# EAGLE design MemoryExpansion (EAGLE 8.3.1)
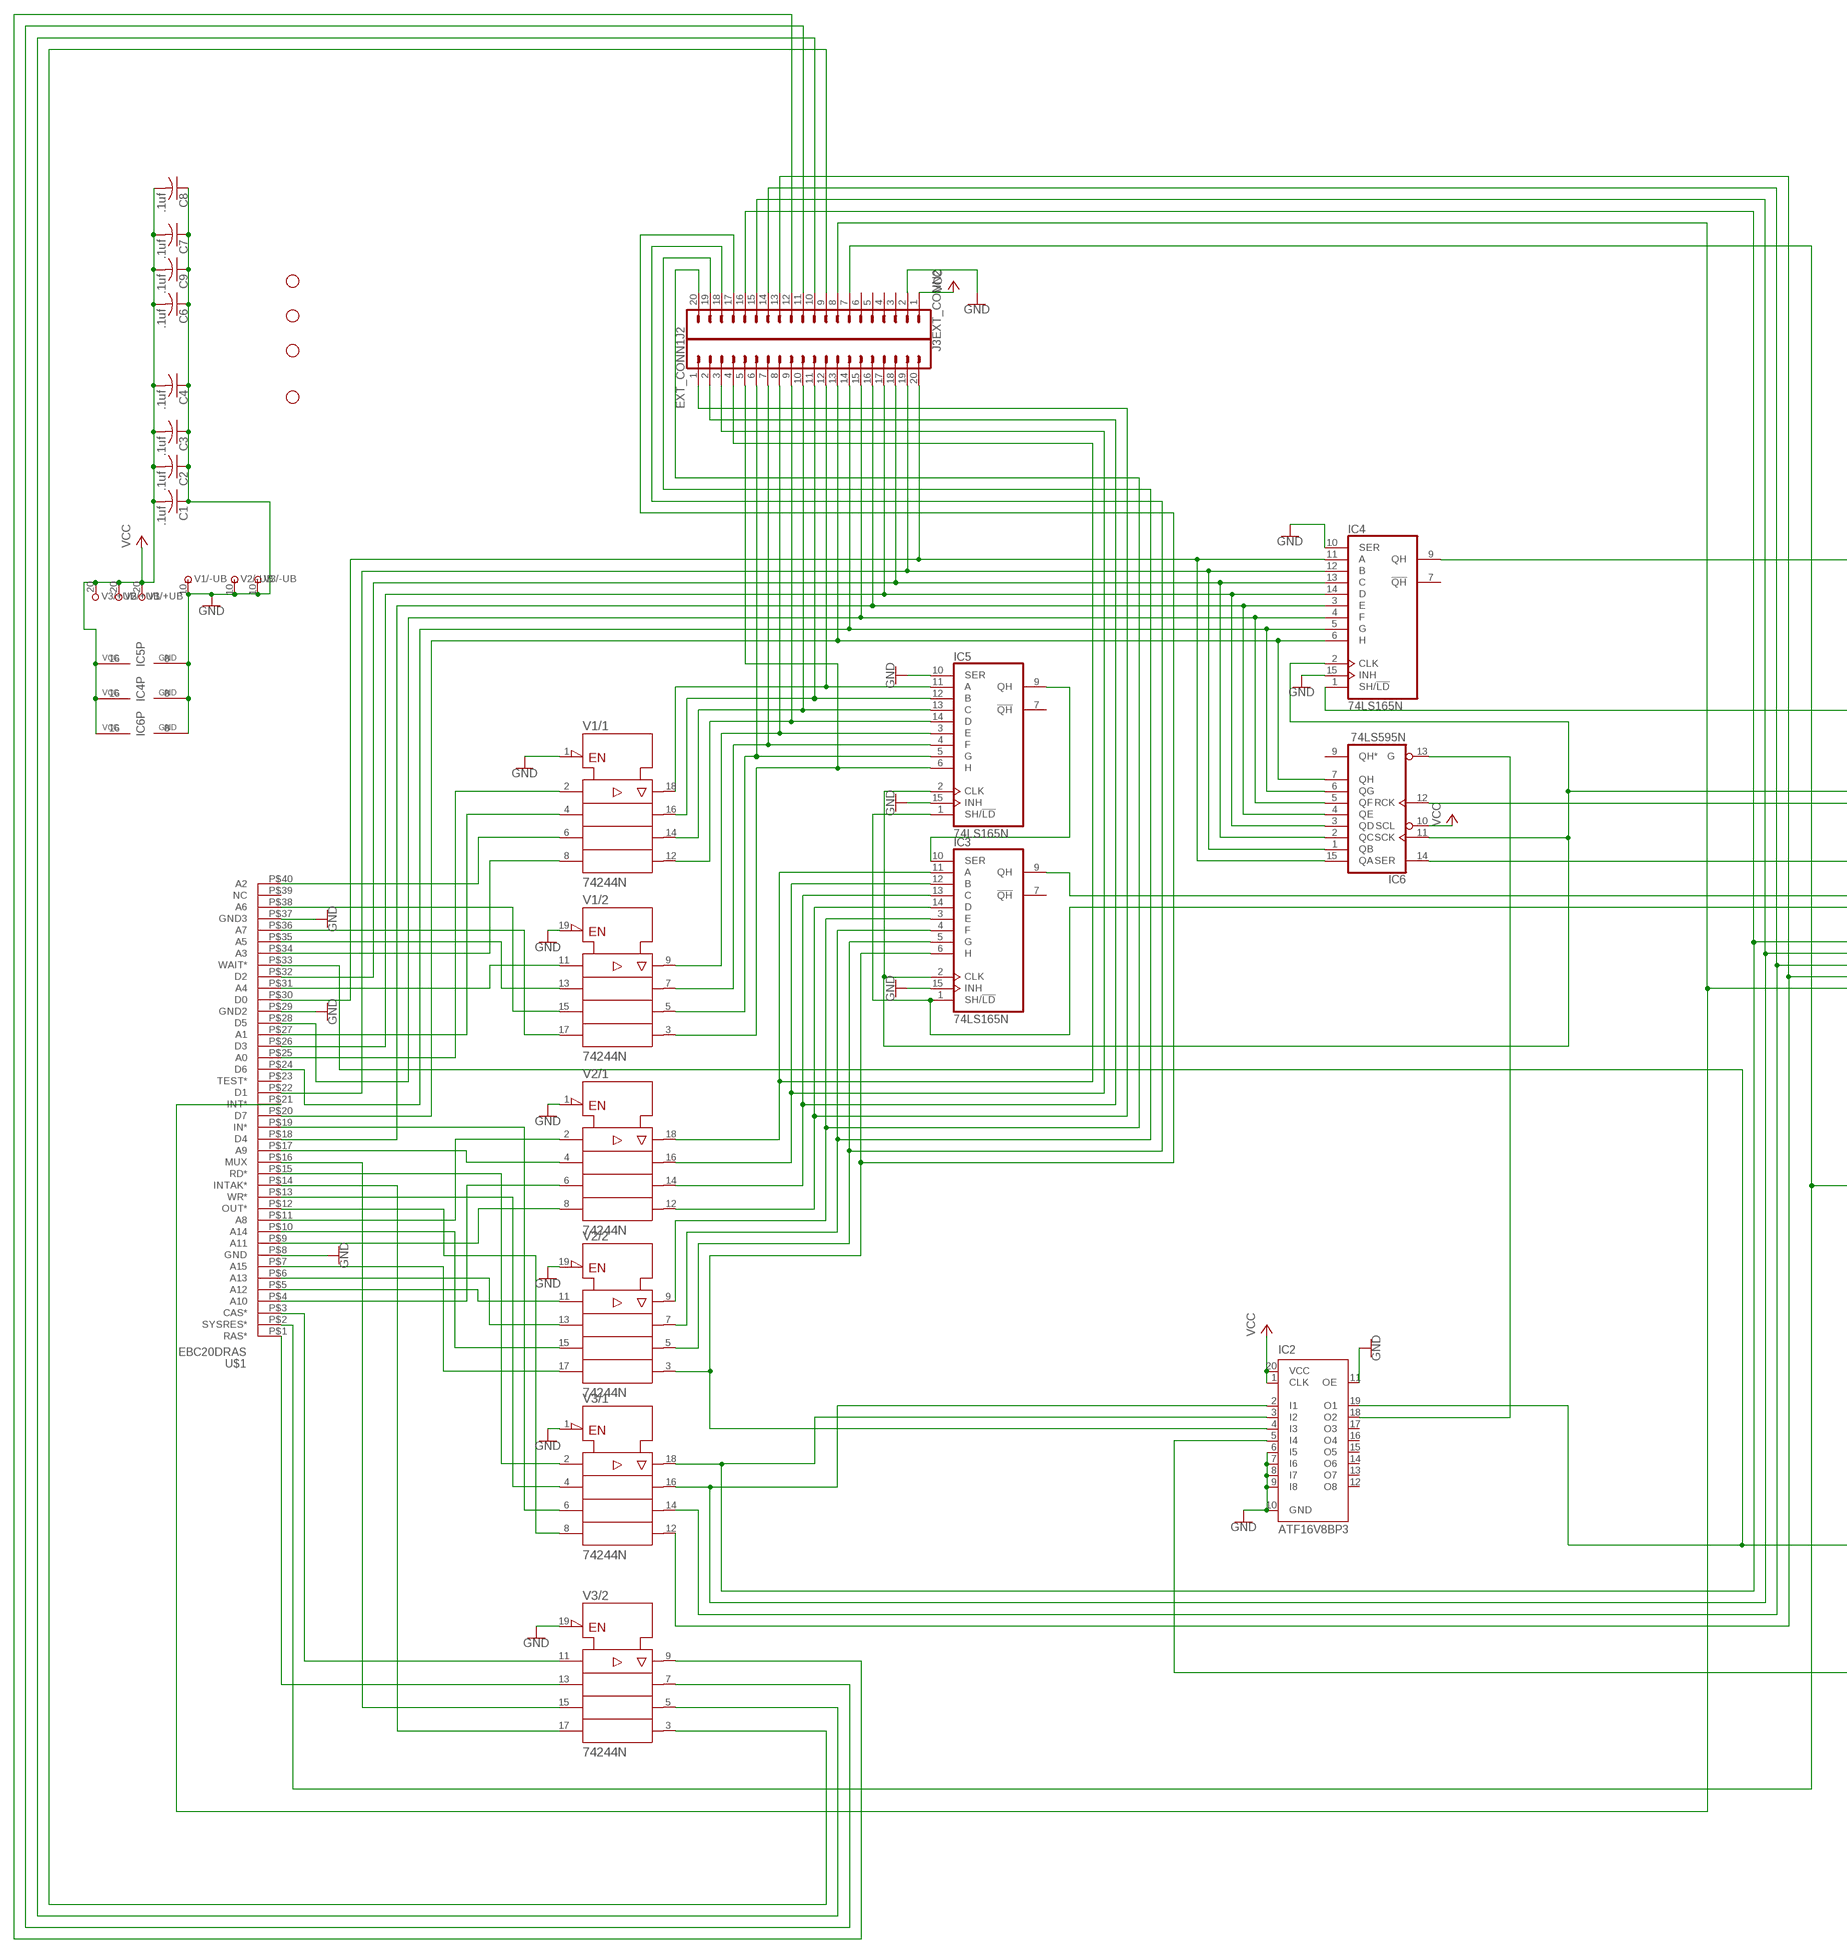
[diagram p0: schematic, sheet 1, part 1 of 2]
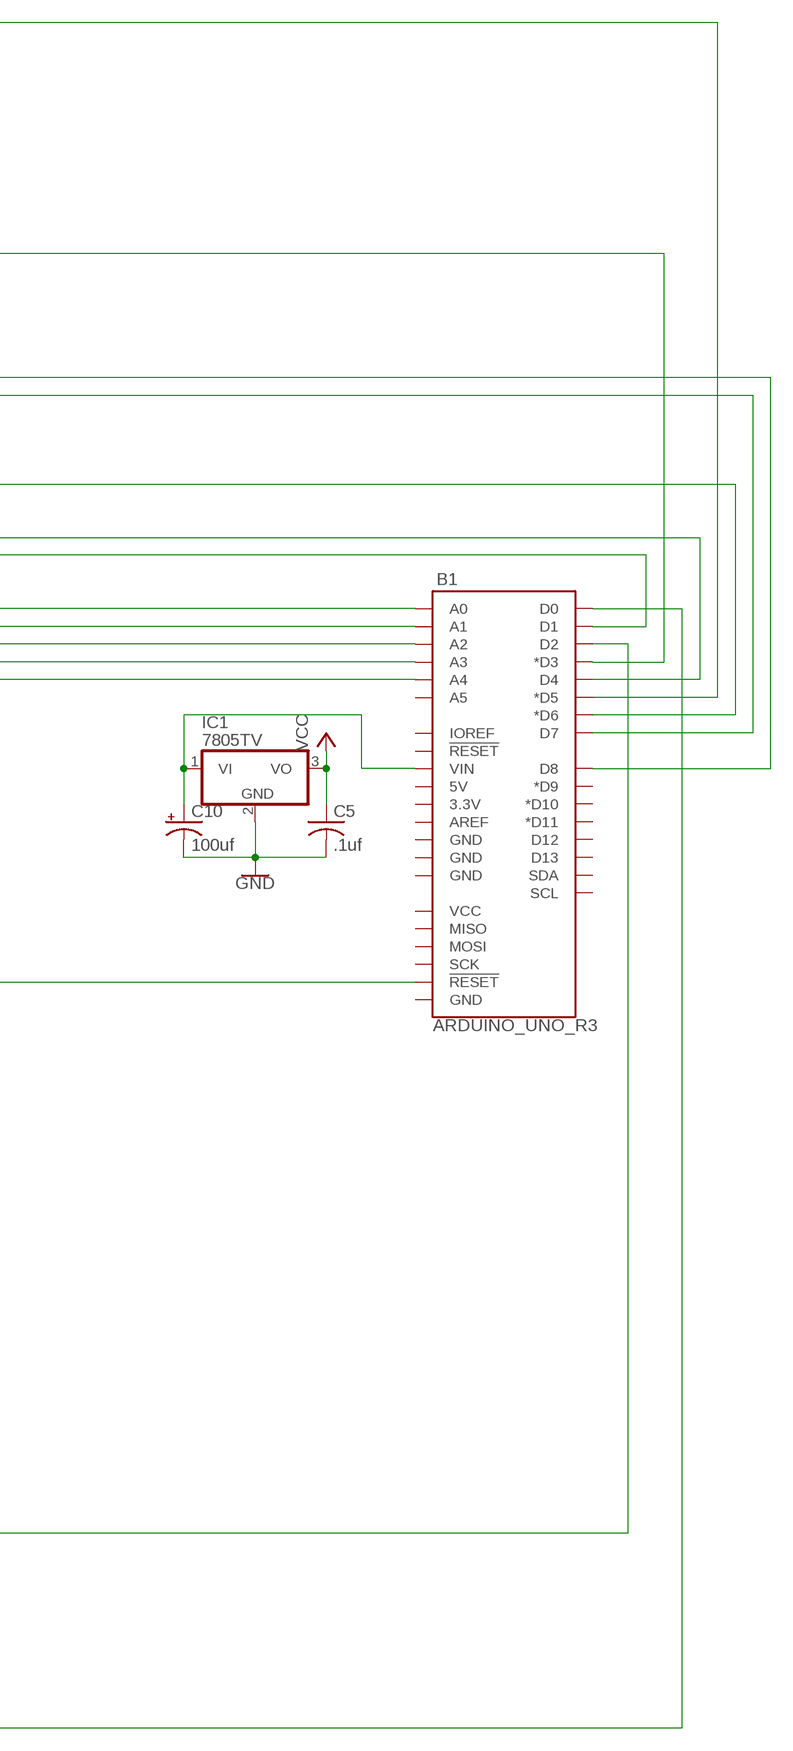
[diagram p1: schematic, sheet 1, part 2 of 2]

## Parts
B1  ARDUINO_UNO_R3  [ARDUINO_R3]
C1  .1uf  C-US025-024X044  [C025-024X044]
C2  .1uf  C-US025-024X044  [C025-024X044]
C3  .1uf  C-US025-024X044  [C025-024X044]
C4  .1uf  C-US025-024X044  [C025-024X044]
C5  .1uf  C-US025-024X044  [C025-024X044]
C6  .1uf  C-US025-024X044  [C025-024X044]
C7  .1uf  C-US025-024X044  [C025-024X044]
C8  .1uf  C-US025-024X044  [C025-024X044]
C9  .1uf  C-US025-024X044  [C025-024X044]
C10  100uf  CPOL-USE2-5  [E2-5]
H1  STAND-OFF  [STAND-OFF]
H2  STAND-OFF  [STAND-OFF]
H3  STAND-OFF  [STAND-OFF]
H4  STAND-OFF  [STAND-OFF]
IC1  7805TV  [TO220V]
IC2  ATF16V8BP3  [DIL20]
IC3  74LS165N  [DIL16]
IC4  74LS165N  [DIL16]
IC5  74LS165N  [DIL16]
IC6  74LS595N  [DIL16]
J2  EXT_CONN2  CONN_20  [1X20]
J3  EXT_CONN1  CONN_20  [1X20]
U$1  EBC20DRAS  [EBC20DRAS]
V1  74244N  [DIL20]
V2  74244N  [DIL20]
V3  74244N  [DIL20]

## Nets
A_12_NET: U$1.P$5(A12) V2.11(/2:A1)
A_13_NET: U$1.P$6(A13) V2.13(/2:A2)
A_14_NET: U$1.P$10(A14) V2.15(/2:A3)
A_15_NET: U$1.P$7(A15) V2.17(/2:A4)
BUF_A_12_NET: IC3.3(E) J2.20 V2.9(/2:Y1)
BUF_A_13_NET: IC3.4(F) J2.19 V2.7(/2:Y2)
BUF_A_14_NET: IC3.5(G) J2.18 V2.5(/2:Y3)
BUF_A_15_NET: IC2.4(I3) IC3.6(H) J2.17 V2.3(/2:Y4)
BUF_IN_N_NET: B1.A2 J2.14 V3.14(/1:Y3)
BUF_OUT_N_NET: B1.A3 J2.13 V3.12(/1:Y4)
BUF_RD_N_NET: B1.A0 IC2.3(I2) J2.16 V3.18(/1:Y1)
BUF_WR_N_NET: B1.A1 IC2.2(I1) J2.15 V3.16(/1:Y2)
DECODE_ENABLE: B1.D0 IC2.5(I4)
GND: C1.1 C2.1 C3.1 C4.1 C5.2 C6.1 C7.1 C8.1 C9.1 C10.- IC1.2(GND) IC2.6(I5) IC2.7(I6) IC2.8(I7) IC2.9(I8) IC2.10(GND) IC2.11(OE) IC3.15(INH) IC4.8(GND) IC4.10(SER) IC4.15(INH) IC5.8(GND) IC5.10(SER) IC5.15(INH) IC6.8(GND) J2.2 U$1.P$8(GND) U$1.P$29(GND2) U$1.P$37(GND3) V1.1(/1:!G) V1.10(/-UB:-UB) V1.19(/2:!G) V2.1(/1:!G) V2.10(/-UB:-UB) V2.19(/2:!G) V3.1(/1:!G) V3.10(/-UB:-UB) V3.19(/2:!G)
IN_N_NET: U$1.P$19(IN*) V3.6(/1:A3)
N$1: U$1.P$25(A0) V1.2(/1:A1)
N$2: U$1.P$27(A1) V1.4(/1:A2)
N$3: U$1.P$40(A2) V1.6(/1:A3)
N$4: U$1.P$34(A3) V1.8(/1:A4)
N$5: U$1.P$31(A4) V1.11(/2:A1)
N$6: U$1.P$35(A5) V1.13(/2:A2)
N$7: U$1.P$38(A6) V1.15(/2:A3)
N$8: U$1.P$36(A7) V1.17(/2:A4)
N$9: U$1.P$11(A8) V2.2(/1:A1)
N$10: U$1.P$17(A9) V2.4(/1:A2)
N$11: U$1.P$4(A10) V2.6(/1:A3)
N$12: U$1.P$9(A11) V2.8(/1:A4)
N$16: B1.VIN C10.+ IC1.1(VI)
N$18: B1.D6(*D6) IC6.14(SER)
N$19: B1.D7 IC6.12(RCK)
N$20: U$1.P$3(CAS*) V3.11(/2:A1)
N$22: IC3.10(SER) IC5.9(QH)
N$23: B1.D8 IC3.2(CLK) IC4.2(CLK) IC5.2(CLK) IC6.11(SCK)
N$24: IC5.11(A) J3.12 V1.18(/1:Y1)
N$25: B1.D1 IC3.1(SH/!LD) IC5.1(SH/!LD)
N$26: B1.D3(*D3) IC4.1(SH/!LD)
N$27: B1.D4 IC3.9(QH)
N$28: B1.D5(*D5) IC4.9(QH)
N$30: B1.A4 J2.8 U$1.P$21(INT*)
N$31: U$1.P$1(RAS*) V3.13(/2:A2)
N$32: U$1.P$16(MUX) V3.15(/2:A3)
N$33: IC5.12(B) J3.11 V1.16(/1:Y2)
N$34: IC5.13(C) J3.10 V1.14(/1:Y3)
N$35: IC5.14(D) J3.9 V1.12(/1:Y4)
N$36: IC5.3(E) J3.8 V1.9(/2:Y1)
N$37: IC5.4(F) J3.7 V1.7(/2:Y2)
N$38: IC5.5(G) J3.6 V1.5(/2:Y3)
N$39: IC5.6(H) J3.5 V1.3(/2:Y4)
N$40: U$1.P$14(INTAK*) V3.17(/2:A4)
N$41: IC3.11(A) J3.4 V2.18(/1:Y1)
N$42: IC3.12(B) J3.3 V2.16(/1:Y2)
N$43: IC3.13(C) J3.2 V2.14(/1:Y3)
N$44: IC3.14(D) J3.1 V2.12(/1:Y4)
N$48: B1.RESET@2(!RESET!) J2.7 U$1.P$2(SYSRES*)
N$50: J2.12 V3.9(/2:Y1)
N$51: J2.11 V3.7(/2:Y2)
N$52: J2.10 V3.5(/2:Y3)
N$53: IC4.11(A) IC6.15(QA) J3.20 U$1.P$30(D0)
N$54: IC4.12(B) IC6.1(QB) J3.19 U$1.P$22(D1)
N$55: IC4.13(C) IC6.2(QC) J3.18 U$1.P$32(D2)
N$56: IC4.14(D) IC6.3(QD) J3.17 U$1.P$26(D3)
N$57: IC4.3(E) IC6.4(QE) J3.16 U$1.P$18(D4)
N$58: IC4.4(F) IC6.5(QF) J3.15 U$1.P$28(D5)
N$59: IC4.5(G) IC6.6(QG) J3.14 U$1.P$24(D6)
N$60: IC4.6(H) IC6.7(QH) J3.13 U$1.P$20(D7)
N$61: J2.9 V3.3(/2:Y4)
OUT_N_NET: U$1.P$12(OUT*) V3.8(/1:A4)
RD_N_NET: U$1.P$15(RD*) V3.2(/1:A1)
RDH_N: IC2.18(O2) IC6.13(G)
VCC: C1.2 C2.2 C3.2 C4.2 C5.1 C6.2 C7.2 C8.2 C9.2 IC1.3(VO) IC2.1(CLK) IC2.20(VCC) IC4.16(VCC) IC5.16(VCC) IC6.10(SCL) IC6.16(VCC) J2.1 V1.20(/+UB:+UB) V2.20(/+UB:+UB) V3.20(/+UB:+UB)
WAIT/: B1.D2 IC2.19(O1) U$1.P$33(WAIT*)
WR_N_NET: U$1.P$13(WR*) V3.4(/1:A2)
Unconnected: B1.3.3V B1.5V B1.A5 B1.AREF B1.D9(*D9) B1.D10(*D10) B1.D11(*D11) B1.D12 B1.D13 B1.GND@1(GND) B1.GND@2(GND) B1.GND@3(GND) B1.GND@4(GND) B1.IOREF B1.MISO B1.MOSI B1.RESET@1(!RESET!) B1.SCK B1.SCL B1.SDA B1.VCC IC2.12(O8) IC2.13(O7) IC2.14(O6) IC2.15(O5) IC2.16(O4) IC2.17(O3) IC3.7(!QH) IC4.7(!QH) IC5.7(!QH) IC6.9(QH*) J2.3 J2.4 J2.5 J2.6 U$1.P$23(TEST*) U$1.P$39(NC)

## Power pins joined to a net without a drawn wire
GND: IC3.8(GND)
VCC: IC3.16(VCC)

## Library data of the parts
B1 = SparkFun-Boards:ARDUINO_UNO_R3: Arduino R3 Footprint with SPI header Arduino Uno R3 Compatible Footprint. Matches PCB size of the original board. SparkFun Products: SAMD21 Dev Breakout <https://www.sparkfun.com/products/13672> RedBoard <https://www.sparkfun.com/products/12757> R3 Stackable Headers <https://www.sparkfun.com/products/11417>
C1-C9 = rcl:C-US: CAPACITOR, American symbol
C10 = rcl:CPOL-US: POLARIZED CAPACITOR, American symbol
H1-H4 = SparkFun-Hardware:STAND-OFF: Stand Off Drill holes for mechanically mounting via screws, standoffs, etc. Note: Use the keepout ring to avoid running the screw head into surrounding components. Variant Overviews STAND-OFF - Mechanical footprint for a #4 phillips button head screw. STAND-OFF-TIGHT - Mechanical footprint for a #4 phillips button head screw, Example SparkFun Products Screw - Phillips Head (1/4", 4-40, 10 pack) <https://www.sparkfun.com/products/10453> (PRT-10453) Screw - Phillips Head (1/2", 4-40, 10 pack) <https://www.sparkfun.com/products/10452> (PRT-10452) Screw - Phillips Head (3/4", 4-40, 10 pack) <https://www.sparkfun.com/products/10451> (PRT-10451) Screw - Phillips Head (1", 4-40, 10 pack) <https://www.sparkfun.com/products/10450> (PRT-10450)
IC1 = linear:78*: Positive VOLTAGE REGULATOR Source: http://cache.national.com/ds/LM/LM78L05.pdf http://www.fairchildsemi.com/ds/LM/LM7805.pdf
IC2 = atmel:ATF16V8B: High perfomance CMOS (electrically erasable) programmable logic device (PLD) ABLE-Atmel-ABEL - P18V8R, P16V8C, P16V8AS, P17V8 COPL Atmel-WinCUPL - G16V8MS, G16V8MA, G16V8AS, G16V8 LOG/IC - GAL16V8_R, GAL16V8_G7, GAL16V8_C), GAL16V8 Tango-PLD - G16V8R, G16V8C, G16V8AS, G16V8 Source: http://www.atmel.com/dyn/resources/prod_documents/DOC0364.PDF; MPN: ATF16V8CZ-15PU; OC_FARNELL: 1551768; OC_NEWARK: 94M6254
IC3-IC5 = 74xx-us:74*165: 8-bit parallel load SHIFT REGISTER
IC6 = 74xx-us:74*595: 8-bit SHIFT REGISTER, output latch
J2 J3 = SparkFun-Connectors:CONN_20: Multi connection point. Often used as Generic Header-pin footprint for 0.1 inch spaced/style header connections On any of the 0.1 inch spaced packages, you can populate with these: Break Away Headers - Straight <https://www.sparkfun.com/products/116> (PRT-00116) Break Away Male Headers - Right Angle <https://www.sparkfun.com/products/553> (PRT-00553) Female Headers <https://www.sparkfun.com/products/115> (PRT-00115) Break Away Headers - Machine Pin <https://www.sparkfun.com/products/117> (PRT-00117) Break Away Female Headers - Swiss Machine Pin <https://www.sparkfun.com/products/743> (PRT-00743) For SCREWTERMINALS and SPRING TERMINALS visit here: Screw Terimnals on SparkFun.com <https://www.sparkfun.com/search/results?term=Screw+Terminals> (5mm/3.5mm/2.54mm spacing) This device is also useful as a general connection point to wire up your design to another part of your project. Our various solder wires solder well into these plated through hole pads. Hook-Up Wire - Assortment (Stranded, 22 AWG) <https://www.sparkfun.com/products/11375> (PRT-11375) Hook-Up Wire - Assortment (Solid Core, 22 AWG) <https://www.sparkfun.com/products/11367> (PRT-11367) View the entire wire category on our website here <https://www.sparkfun.com/categories/141> Special notes: Molex polarized connector foot print use with SKU : PRT-08231 with associated crimp pins and housings. 1MM SMD Version SKU: PRT-10208 NOTES ON THE VARIANTS LOCK and LOCK_LONGPADS... This footprint was designed to help hold the alignment of a through-hole component (i.e. 6-pin header) while soldering it into place. You may notice that each hole has been shifted either up or down by 0.005 of an inch from it's more standard position (which is a perfectly straight line). This slight alteration caused the pins (the squares in the middle) to touch the edges of the holes. Because they are alternating, it causes a "brace" to hold the component in place. 0.005 has proven to be the perfect amount of "off-center" position when using our standard breakaway headers. Although looks a little odd when you look at the bare footprint, once you have a header in there, the alteration is very hard to notice. Also,if you push a header all the way into place, it is covered up entirely on the bottom side. Note about LOCK SPECIAL package: This is just like the LOCK variant in that the holes are staggared by 5 mil, but except for the last two holes. They are not altered from the "standard" footprint layout. This is used for a special purpose on the layout of our Graphic LCD Backpack. Make sure you want to use this device before selecting it for you project!
U$1 = TMS99:EBC20DRAS
V1-V3 = 74ttl-din:74*244: Octal BUFFER and LINE DRIVER, 3-state

## Board
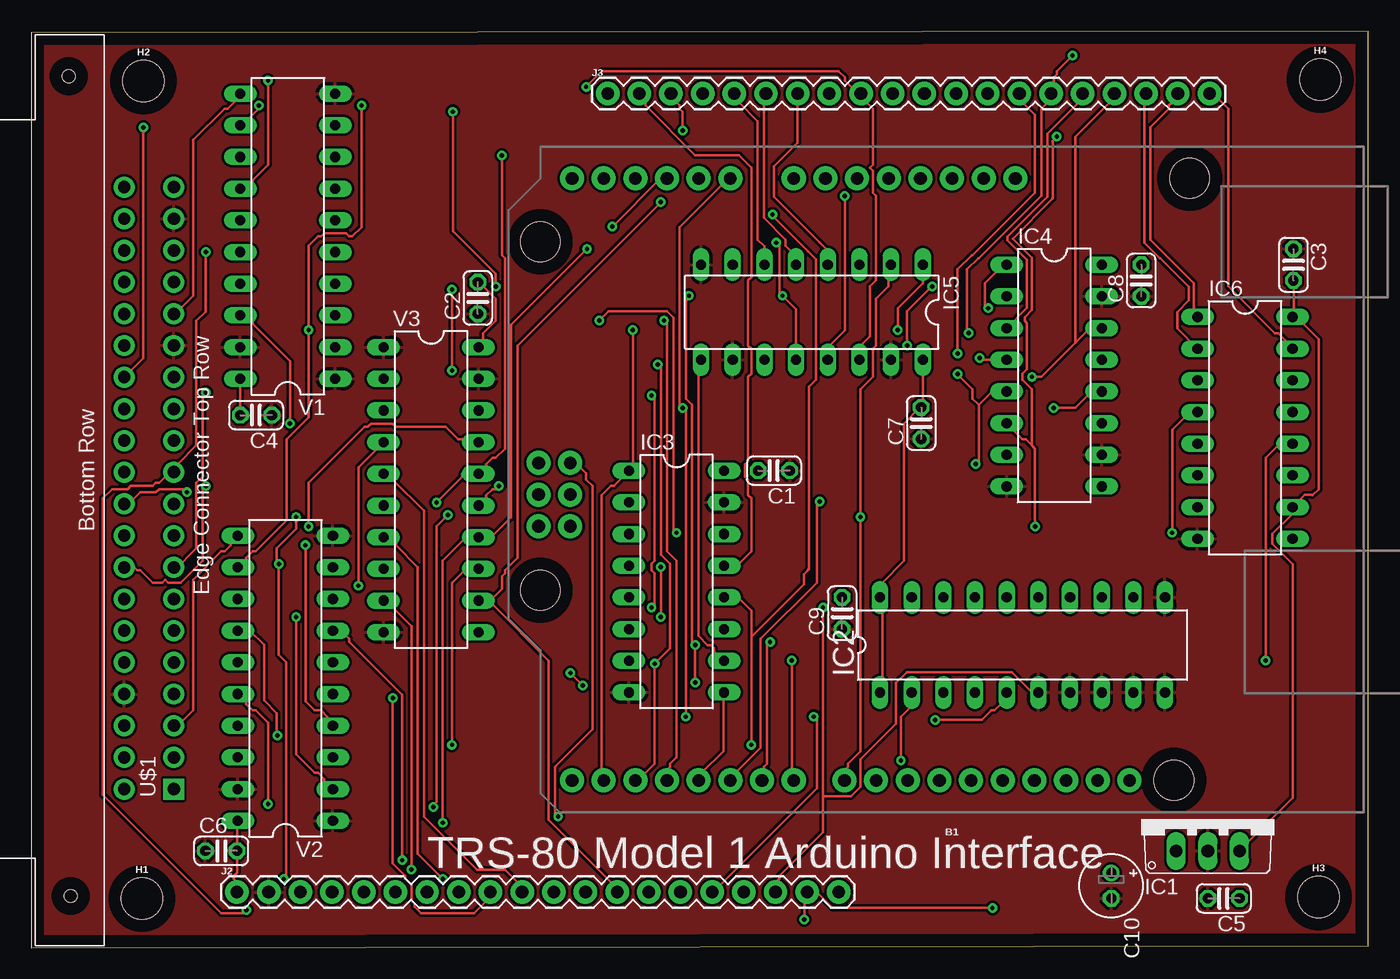
[diagram p2: board, top side]
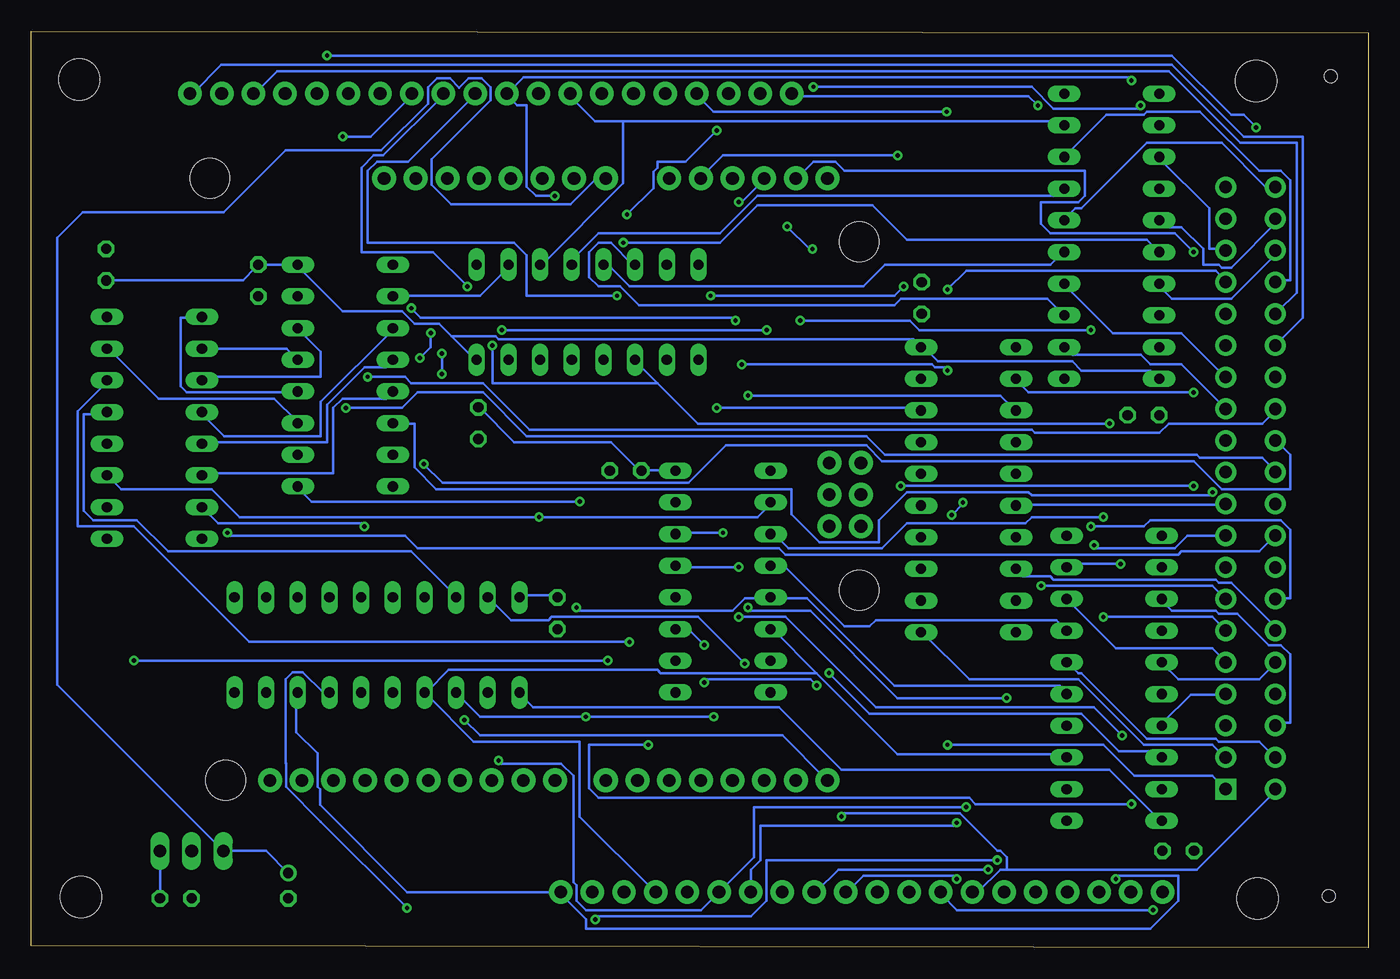
[diagram p3: board, bottom side, seen from below]

Size 107.23 x 73.46 mm. Coordinates in mm from the lower left corner, seen from the top.
Outline: 0,0 107.23,0.13 107.23,73.46 0,73.33 0,0
Copper layers (1*16): Top 0.035mm / dielectric 1.5mm / Bottom 0.035mm
Design rules "default": minimum track width 0.2mm, minimum drill 0.35mm, track to track 8mil, track to pad 8mil, pad to pad 8mil, via to via 8mil, smd to smd 8mil, copper to edge 40mil, drill to drill 6mil, minimum pad ring 10mil, minimum via ring 8mil, stop-mask expansion 4mil, vias tented up to drill 0mil, thermal gap 10mil

### Footprints (pad centres in the part's own frame; a part is rotated, then mirrored left to right if it is on the bottom)
ARDUINO_R3 = drill 1.016 pad 1.93: 3.3V 2.54,-24.13; 5V 5.08,-24.13; A0 17.78,-24.13; A1 20.32,-24.13; A2 22.86,-24.13; A3 25.4,-24.13; A4 27.94,-24.13; A5 30.48,-24.13; AREF -9.144,24.13; D0 30.48,24.13; D1 27.94,24.13; D2 25.4,24.13; D3 22.86,24.13; D4 20.32,24.13; D5 17.78,24.13; D6 15.24,24.13; D7 12.7,24.13; D8 8.636,24.13; D9 6.096,24.13; D10 3.556,24.13; D11 1.016,24.13; D12 -1.524,24.13; D13 -4.064,24.13; GND@1 7.62,-24.13; GND@2 10.16,-24.13; GND@3 -6.604,24.13; GND@4 33.16,-1.32; IOREF -2.54,-24.13; MISO 30.62,3.76; MOSI 33.16,1.22; NC -5.08,-24.13; RESET@1 0,-24.13; RESET@2 30.62,-1.32; SCK 30.62,1.22; SCL -14.224,24.13; SDA -11.684,24.13; VCC 33.16,3.76; VIN 12.7,-24.13 | hole 3.175: -17.78,24.13; 33.02,8.89; 33.02,-19.05; -19.05,-24.13
C025-024X044 = drill 0.813 octagon: 1 -1.27,0; 2 1.27,0
E2-5 = drill 0.813 pad 1.27: + -1.016,0 | drill 0.813 pad 1.27 octagon: - 1.016,0
STAND-OFF = hole 3.302: 0,0
TO220V = drill 1.016 long: 1 -2.54,-2.54; 2 0,-2.54; 3 2.54,-2.54
DIL20 = drill 0.813 long: 1 -11.43,-3.81; 2 -8.89,-3.81; 3 -6.35,-3.81; 4 -3.81,-3.81; 5 -1.27,-3.81; 6 1.27,-3.81; 7 3.81,-3.81; 8 6.35,-3.81; 9 8.89,-3.81; 10 11.43,-3.81; 11 11.43,3.81; 12 8.89,3.81; 13 6.35,3.81; 14 3.81,3.81; 15 1.27,3.81; 16 -1.27,3.81; 17 -3.81,3.81; 18 -6.35,3.81; 19 -8.89,3.81; 20 -11.43,3.81
DIL16 = drill 0.813 long: 1 -8.89,-3.81; 2 -6.35,-3.81; 3 -3.81,-3.81; 4 -1.27,-3.81; 5 1.27,-3.81; 6 3.81,-3.81; 7 6.35,-3.81; 8 8.89,-3.81; 9 8.89,3.81; 10 6.35,3.81; 11 3.81,3.81; 12 1.27,3.81; 13 -1.27,3.81; 14 -3.81,3.81; 15 -6.35,3.81; 16 -8.89,3.81
1X20 = drill 1.016 pad 1.88: 1 0,0; 2 2.54,0; 3 5.08,0; 4 7.62,0; 5 10.16,0; 6 12.7,0; 7 15.24,0; 8 17.78,0; 9 20.32,0; 10 22.86,0; 11 25.4,0; 12 27.94,0; 13 30.48,0; 14 33.02,0; 15 35.56,0; 16 38.1,0; 17 40.64,0; 18 43.18,0; 19 45.72,0; 20 48.26,0
EBC20DRAS = drill 1 pad 1.676 square: P$1 0,0 | drill 1 pad 1.676: P$2 0,3.969; P$3 2.54,0; P$4 2.54,3.969; P$5 5.08,0; P$6 5.08,3.969; P$7 7.62,0; P$8 7.62,3.969; P$9 10.16,0; P$10 10.16,3.969; P$11 12.7,0; P$12 12.7,3.969; P$13 15.24,0; P$14 15.24,3.969; P$15 17.78,0; P$16 17.78,3.969; P$17 20.32,0; P$18 20.32,3.969; P$19 22.86,0; P$20 22.86,3.969; P$21 25.4,0; P$22 25.4,3.969; P$23 27.94,0; P$24 27.94,3.969; P$25 30.48,0; P$26 30.48,3.969; P$27 33.02,0; P$28 33.02,3.969; P$29 35.56,0; P$30 35.56,3.969; P$31 38.1,0; P$32 38.1,3.969; P$33 40.64,0; P$34 40.64,3.969; P$35 43.18,0; P$36 43.18,3.969; P$37 45.72,0; P$38 45.72,3.969; P$39 48.26,0; P$40 48.26,3.969 | hole 1: -8.572,8.255; 57.15,8.414

### Placement (x,y rotation side)
B1  73.85,37.53 180 top
C1  59.56,38.23 180 top
C2  35.81,52.07 90 top
C3  101.22,54.74 270 top
C4  18.03,42.67 180 top
C5  95.63,3.94 180 top
C6  15.24,7.75 0 top
C7  71.37,42.04 90 top
C8  89.03,53.47 90 top
C9  65.02,26.8 90 top
C10  86.61,4.95 270 top
H1  8.89,3.94 0 top
H2  9.02,69.47 0 top
H3  103.25,4.06 0 top
H4  103.38,69.6 0 top
IC1  94.36,10.29 0 top
IC2  79.5,24.26 0 top
IC3  51.75,29.34 270 top
IC4  82.04,45.85 270 top
IC5  62.61,50.93 180 top
IC6  97.35,41.66 270 top
J2  16.51,4.45 0 top
J3  46.23,68.45 0 top
U$1  11.43,12.7 90 top
V1  20.57,57.02 90 top
V2  20.38,21.59 90 top
V3  32.07,36.7 270 top

### Tracks (layer width: path | path; a pad name or v marks a point on that pad's centre or on a via)
A_12_NET
  Top 0.2: V2.11 16.5,33 16,32.5 16,32.25 15.5,31.75 15.25,31.75 13,29.5 13,19 12,18 11.5,18 U$1.P$5
A_13_NET
  Bottom 0.2: V2.13 16.5,27.75 15.75,27 12.25,27 12,26.75 10.5,26.75 8,24.25 7,24.25 6.25,23.5 6.25,18 7.25,18 U$1.P$6
A_14_NET
  Bottom 0.2: V2.15 16.5,22.75 15.25,21.5 8.75,21.5 7.5,22.75 U$1.P$10
A_15_NET
  Bottom 0.2: V2.17 16.5,18 14.25,20.25 11.5,20.25 U$1.P$7
BUF_A_12_NET  (via drill 0.35)
  Top 0.2: v21.25,34.5 21.25,33.57 19.68,32 19.68,30.92 v19.85,30.75 19.85,23.45 20.45,22.86 20.45,5.7 v20.25,5.5
  Bottom 0.2: v19.85,30.75 23.75,30.75 24,30.5 V2.9 | v21.25,34.5 27,34.5 27.5,34 37,34 39,32 46.5,32 47.5,33 47.75,33 IC3.3 | v20.25,5.5 20,5.75 15.25,5.75 15.25,3.75 17.5,1.5 62.75,1.5 62.75,2.25 64.75,4.25 J2.20 77.09,4.45 84.07,11.43 84.07,12.68 84.26,12.87 84.26,15.56 85.98,17.27 85.98,20.32
BUF_A_13_NET  (via drill 0.35)
  Top 0.2: v62,2.25 62,4.25 J2.19 63.01,4.45 64.25,3.2 77.06,3.2 v77.09,3.17 | v29.75,7 29.75,20.25 25.5,24.5 25.5,24.75 25,25.25 24.25,25.25 V2.7
  Bottom 0.2: V2.7 24.25,25.5 25,26.25 39.5,26.25 40,25.75 42,25.75 46.75,30.5 47.75,30.5 IC3.4 | v62,2.25 61.75,2.5 49.5,2.5 48.25,3.75 48.25,7 v29.75,7 | v77.09,3.17 84.01,10.1 84.03,10.1 86.8,12.87 86.8,14.77 86.82,14.78 86.82,21.51 86.25,22.07 85.45,22.07 83.83,20.45
BUF_A_14_NET  (via drill 0.35)
  Top 0.2: 63.5,12.1 v63.5,27.25 | 63.5,12.1 63.5,9.25 60,5.75 60,5.5 59.75,5.25 59.75,4.5 J2.18 | 63.5,12.1 63.53,12.13 65.74,12.13 66.48,12.87 66.48,15.09 69.35,17.95 69.35,21.2 70.21,22.07 78.63,22.07 80.25,20.45
  Bottom 0.2: V2.5 24.25,20.5 24.75,21 38,21 45,28 47.75,28 IC3.5 48,28 50,28 51,27 63.25,27 v63.5,27.25
BUF_A_15_NET
  Bottom 0.2: 44.25,22 47.75,25.5 IC3.6 | 44.25,22 37.75,15.5 24.5,15.5 24.25,15.25 V2.3 | 44.25,22 56.75,22 57,22.25 73.75,22.25 75.5,20.5 IC2.4 75.5,20.25 71.75,16.5 63.25,16.5 63.25,10.5 57.25,4.5 J2.17
BUF_IN_N_NET  (via drill 0.35)
  Top 0.2: v33,10 33,31 34.75,32.75 35.75,32.75 V3.14 36,33 37,33 38.5,34.5 38.5,49.93 v44.58,56.01 | B1.A2 50.48,61.66 v46.61,57.78
  Bottom 0.2: v33,10 33.25,9.75 48.75,9.75 48.75,7 49.5,6.25 49.5,4.5 J2.14 | v44.58,56.01 44.83,56.01 v46.61,57.78
BUF_OUT_N_NET  (via drill 0.35)
  Top 0.2: 37,27.75 36,27.75 V3.12 37,27.75 | 37,27.75 37,27.5 41.5,23 41.5,10.25 46.75,5 46.75,4.5 J2.13 | v50.5,59.75 39,48.25 39,31.25 38,30.25 38,30 37.75,29.75 37.75,28.75 37,28 37,27.75
  Bottom 0.2: v50.5,59.75 50.25,59.75 48.5,61.5 B1.A3
BUF_RD_N_NET  (via drill 0.35)
  Top 0.2: v62.75,18.5 63,18.25 63,12.75 54.75,4.5 J2.16 | B1.A0 56,61.75 52,57.75 52,43.5 v52.25,43.25 52.5,43 v52.5,18.5
  Bottom 0.2: IC2.3 73,20.25 71.25,18.5 v62.75,18.5 v52.5,18.5 | v52.25,43.25 36,43.25 V3.18
BUF_WR_N_NET  (via drill 0.35)
  Top 0.2: v69.75,15 69.75,18.5 70.5,19.25 70.5,20.25 IC2.2 | v37.75,63.5 37.75,55.5 38,55.25 38,40 37.25,39.25 37,39.25 36.5,38.75 36.5,38.5 36,38 V3.16 34.54,37.97 34.54,37.72 v32.51,35.69 | v32.25,11.25 32.25,11.42 32.51,11.68 32.51,33.78 v33.4,34.67
  Bottom 0.2: v69.75,15 69.5,14.75 64.75,14.75 63.75,13.75 63.75,5.25 63.5,5 63.5,3.75 62.75,3 53.5,3 52.25,4.25 J2.15 52,4.5 49.25,7.25 49.25,11.25 v32.25,11.25 | v37.75,63.5 51.75,63.5 53.5,61.75 B1.A1 | 33.27,34.67 v33.4,34.67 32.51,35.56 v32.51,35.69
DECODE_ENABLE  (via drill 0.35)
  Top 0.2: v72.5,18.25 76.25,18.25 77,19 77.25,19 77.75,19.5 77.75,20 78,20.25 IC2.5
  Bottom 0.2: v72.5,18.25 71.25,17 47,17 43.5,13.5 B1.D0
GND
  pour Top: 0,73.66 0,0 107.12,0 107.12,73.66
IN_N_NET
  Bottom 0.2: V3.6 28.25,35.5 11.5,35.5 U$1.P$19
N$1
  Bottom 0.2: U$1.P$25 15,46.75 17.5,46.75 18.25,47.5 23.75,47.5 24.25,48 V1.2
N$2
  Bottom 0.2: V1.4 24.25,53 20.5,49.25 15,49.25 11.5,45.75 U$1.P$27
N$3
  Bottom 0.2: V1.6 24.25,58.5 23.5,59.25 23,59.25 17.75,64.5 11.75,64.5 8.25,61 7.5,61 U$1.P$40
N$4
  Bottom 0.2: V1.8 24.25,63.5 21,66.75 18,66.75 17.75,67 13.5,67 8.75,62.25 7,62.25 6.25,61.5 6.25,53.5 7.25,53.5 U$1.P$34
N$5
  Top 0.2: V1.11 16.75,68.25 15.75,67.25 15.5,67.25 13,64.75 13,52.25 11.5,50.75 U$1.P$31
N$6
  Bottom 0.2: V1.13 16.75,63.25 12.75,59.25 12.75,56 11.5,56 U$1.P$35
N$7
  Bottom 0.2: V1.15 16.75,58.25 16.25,57.75 15,57.75 13.25,56 13.25,54.75 12,54.75 11.75,54.5 11,54.5 7.25,58.25 U$1.P$38
N$8
  Bottom 0.2: V1.17 16.75,53 15.75,52 11,52 7.25,55.75 U$1.P$36
N$9  (via drill 0.35)
  Top 0.2: v21.25,26.5 21.25,15.5 22.75,14 23,14 23.5,13.5 23.5,13.25 24,12.75 V2.2
  Bottom 0.2: v21.25,26.5 12.5,26.5 11.5,25.5 U$1.P$11
N$10  (via drill 0.35)
  Top 0.2: v22,32.25 22,19.75 22.75,19 23.25,19 23.75,18.5 23.75,18.25 24,18 V2.4
  Bottom 0.2: v22,32.25 21.75,32 15.5,32 14.5,33 11.5,33 U$1.P$17
N$11
  Bottom 0.2: V2.6 24,22.75 23.25,22 23,22 17.75,16.75 12.25,16.75 12,16.5 8.75,16.5 7.5,15.25 U$1.P$4
N$12
  Bottom 0.2: V2.8 24,27.75 20.25,24 12.5,24 11.5,23 U$1.P$9
N$16
  Bottom 0.2: C10.+ 88.39,7.75 IC1.1 105.16,21.08 105.16,56.9 103.1,58.95 91.78,58.95 86.83,63.9 79.17,63.9 75.41,67.66 75.41,68.97 74.68,69.7 73.65,69.7 72.9,68.94 72.14,69.7 71.11,69.7 70.39,68.97 70.39,67.94 75.12,63.2 75.12,61.14 73.55,59.57 63.99,59.57 61.9,61.66 B1.VIN
N$18  (via drill 0.35)
  Top 0.2: v59.25,24.5 59,24.25 59,14.75 58.75,14.5 58.75,13.5 B1.D6
  Bottom 0.2: v59.25,24.5 89.75,24.5 99,33.75 103.5,33.75 103.5,43 101.25,45.25 IC6.14
N$19  (via drill 0.35)
  Top 0.2: v99,23 99,39.25 100,40.25 101,40.25 IC6.12 | v61,23 61,13.5 B1.D7
  Bottom 0.2: v61,23 v99,23
N$20
  Bottom 0.2: V3.11 35.75,25.25 32,21.5 23.25,21.5 18,16.25 12.5,16.25 11.5,15.25 U$1.P$3
N$22
  Top 0.2: IC3.10 55.5,23 54.75,23.75 54.75,24 54.5,24.25 54.25,24.25 53.5,25 53.5,47 IC5.9
N$23  (via drill 0.35)
  Top 0.2: B1.D8 65.25,13.5 65.25,14.25 65.5,14.5 65.5,14.75 66.5,15.75 v66.5,34.5 66.5,44.75 67.5,45.75 67.5,48 67.75,48.25 67.75,52 68.75,53 68.75,54.5 IC5.2
  Bottom 0.2: IC5.2 69,54.5 71.25,52.25 78,52.25 IC4.2 | IC3.2 48,35.5 49,34.5 v66.5,34.5 90.5,34.5 92.75,36.75 100,36.75 101,37.75 IC6.11
N$24  (via drill 0.35)
  Top 0.2: v20.75,42 20.75,47 17.75,50 17.75,50.5 17,50.5 V1.18 | v72.25,53 70.25,51 v70.25,48.25
  Bottom 0.2: v20.75,42 53.75,42 57,45.25 | 57,45.25 58.75,47 IC5.11 | v72.25,53 75,55.75 80.75,55.75 80.75,62.5 79.75,63.5 79,63.5 74.25,68.25 J3.12 | v70.25,48.25 70.25,45.25 57,45.25
N$25  (via drill 0.35)
  Top 0.2: B1.D1 45.75,13.5 45.75,36.25 46.5,37 46.75,37 47.75,38 IC3.1 48,38.25 48.25,38.5 v48.25,49.5 | v69.5,49.5 69.5,51.25 71.5,53.25 71.5,54.5 IC5.1
  Bottom 0.2: v48.25,49.5 v69.5,49.5
N$26  (via drill 0.35)
  Top 0.2: v76.75,51.25 76.5,51.5 76.5,53.25 77.5,54.25 77.5,54.5 78,54.5 IC4.1 | v50.75,50.25 51,50 51,31.75 51.75,31 51.75,15.25 51.25,14.75 51.25,14.5 51,14.25 51,13.5 B1.D3
  Bottom 0.2: v76.75,51.25 76,50.5 51,50.5 v50.75,50.25
N$27
  Top 0.2: IC3.9 55.5,20.25 55.5,15.75 53.75,14 53.75,13.5 B1.D4
N$28  (via drill 0.35)
  Top 0.2: v63.25,35.75 63,35.5 63,29.25 58.5,24.75 58.5,16 56.25,13.75 56.25,13.5 B1.D5
  Bottom 0.2: v63.25,35.75 84.75,35.75 85.75,36.75 IC4.9
N$30  (via drill 0.35)
  Top 0.2: v14,55.75 14,50.98 13.25,50.23 13.25,40.25 11.75,38.75 11.75,38.5 11.5,38.25 U$1.P$21 11.25,38.25 10.25,37.25 10,37.25 9.75,37 8,37 7.75,36.75 6.5,36.75 5.75,36 5.75,12.25 15.25,2.75 17,2.75 v17.25,3
  Bottom 0.2: v14,55.75 15.5,57.25 25.5,57.25 26.25,58 26.25,59.75 23.25,59.75 22.75,60.25 22.75,62.25 42,62.25 42.75,63 44.5,63 45.75,61.75 B1.A4 | v17.25,3 33,3 34.25,4.25 J2.8
N$31  (via drill 0.35)
  Top 0.2: v33.75,16.25 33.75,29.25 34.75,30.25 35.75,30.25 V3.13
  Bottom 0.2: v33.75,16.25 21.25,16.25 18.75,13.75 12.5,13.75 11.5,12.75 U$1.P$1
N$32  (via drill 0.35)
  Top 0.2: v37.5,37 37.25,36.75 37,36.75 36.5,36.25 36.5,36 36,35.5 V3.15 | v14,37 13.75,36.75 13.75,31 12,29.25 11,29.25 10.75,29.5 10.5,29.25 9.75,29.25 8.75,30.25 8.5,30.25 8.25,30.5 7.5,30.5 U$1.P$16
  Bottom 0.2: v14,37 v37.5,37
N$33  (via drill 0.35)
  Top 0.2: v59.75,56.5 60,56.25 60,52.25 v60.25,52.25 61.34,51.16 IC5.12 61.25,47
  Bottom 0.2: v59.75,56.5 52,56.5 49,59.5 39.75,59.5 37,56.75 17.75,56.75 17,56 V1.16 | v60.25,52.25 67.5,52.25 67.5,55.5 68.5,56.5 80.25,56.5 80.25,62.25 79.5,63 77,63 71.75,68.25 J3.11
N$34  (via drill 0.35)
  Top 0.2: v19,69.5 19,62.75 17.75,61.5 17.75,61 17,61 V1.14 | v65.25,60.25 65.25,49.5 64,48.25 64,47.25 IC5.13
  Bottom 0.2: v19,69.5 19.25,69.75 67.75,69.75 69,68.5 J3.10 69,68.25 68.25,67.5 67.5,67.5 67.5,61 66.75,60.25 v65.25,60.25
N$35  (via drill 0.35)
  Top 0.2: v18.25,67.5 18.25,67.25 17,66 V1.12 | v44.5,69 45.75,70.25 64.75,70.25 65.25,69.75 65.25,69.5 66.5,68.25 J3.9 66.75,68.25 66.75,68 67.5,67.25 67.5,62.75 67.25,62.5 67.5,62.25 67.5,60.5 67.75,60.25 67.75,53.5 67.25,53 67.25,49 66.5,48.25 66.5,47.25 IC5.14
  Bottom 0.2: v18.25,67.5 18.5,67.25 25.25,67.25 27,69 v44.5,69
N$36
  Bottom 0.2: 59.75,66.25 62,66.25 64,68.25 J3.8 | 59.75,66.25 24.75,66.25 24.5,66 V1.9 | 59.75,66.25 59.75,61.25 66.25,54.75 IC5.3
N$37
  Top 0.2: IC5.4 63.75,54.75 63.75,56 63.25,56.5 63.25,56.51 59.56,60.2 59.56,62.61 61.47,64.52 J3.7
  Bottom 0.2: V1.7 24.5,60.75 25,60.25 49,60.25 52,57.25 61.75,57.25 63.75,55.25 63.75,54.75 IC5.4
N$38
  Top 0.2: J3.6 58.75,68.25 58.75,58.5 60.5,56.75 60.5,56.25 61.25,55.5 61.25,54.75 IC5.5
  Bottom 0.2: V1.5 24.5,55.75 25.5,54.75 38.75,54.75 40.5,53 59.25,53 60.75,54.5 61.25,54.5 IC5.5
N$39
  Top 0.2: J3.5 56.5,68.25 56.75,68 56.75,67.75 58.25,66.25 58.25,56.75 58.8,56.2 IC5.6
  Bottom 0.2: V1.3 24.5,50.75 25.75,52 37.5,52 38,51.5 58.5,51.5 60,53 61.75,53 62.5,53.75 62.5,55.75 61.75,56.5 60.75,56.5 59,54.75 IC5.6
N$40  (via drill 0.35)
  Top 0.2: v22.25,33.75 22.25,37.25 26.75,41.75 27,41.75 27.25,42 29,42 29.25,41.75 33.25,41.75 34.25,40.75 35.75,40.75 V3.17
  Bottom 0.2: v22.25,33.75 18,33.75 17.5,34.25 7,34.25 6.25,33.5 6.25,28 7.25,28 U$1.P$14
N$41  (via drill 0.35)
  Top 0.2: v44.25,21 v43.25,22 | v53.25,21.25 v53.25,24.25 53,24.5 53,43.5 52.5,44 52.5,52 v52.75,52.25 | v37.25,53 37.25,54 33.83,57.42 v33.83,67
  Bottom 0.2: v43.25,22 40,18.75 23,18.75 20,15.75 17.25,15.75 16.75,15.25 V2.18 | v44.25,21 44.75,21.5 53,21.5 v53.25,21.25 | v53.25,24.25 54.5,25.5 55.5,25.5 IC3.11 | v33.83,67 52.5,67 53.75,68.25 J3.4 | v37.25,53 38,52.25 v52.75,52.25
N$42  (via drill 0.35)
  Top 0.2: v19,11.5 19,18 18,19 17.75,19 17.25,19.5 17.25,19.75 16.75,20.25 V2.16 | 57.75,24.92 57.75,27 56.75,28 55.75,28 IC3.12 | 57.75,24.92 v57.75,16.25 | v52.25,65.5 52.25,67 52,67.25 52,67.5 51.75,67.75 51.75,68 51.5,68.25 J3.3 | v59.45,58.77 59.45,58.65 62.3,55.8 62.31,55.8 62.92,55.19 62.92,45.52 62.36,44.96 62.36,30.33 62.25,30.22 | 57.75,24.92 61.96,29.13 61.96,29.93 62.25,30.22 | 62.25,30.22 62.3,30.28
  Bottom 0.2: v19,11.5 31.5,11.5 32,12 61.75,12 62.5,12.75 62.5,16.25 v57.75,16.25 | v52.25,65.5 54.75,63 57,63 57,62.52 57.34,62.18 57.34,60.88 v59.45,58.77
N$43  (via drill 0.35)
  Top 0.2: v50.5,30.5 v50.5,26.5 | 16.75,25.25 V2.14 17.53,25.4 18.67,24.26 18.67,19.81 19.68,18.8 19.68,17.07 v19.75,17 | J3.2 49,68.25 49.25,68 49.25,67.5 53.25,63.5 56.75,63.5 57.75,62.5 57.75,53.75 57.5,53.5 57.5,48.25 57.75,48 57.75,46 57.5,45.75 57.5,39 57.25,38.75 57.25,37.75 57.5,37.5 57.5,36.25 57.75,36 57.75,31.75 56.75,30.75 55.75,30.75 IC3.13
  Bottom 0.2: v19.75,17 22,19.25 39.5,19.25 46.75,26.5 v50.5,26.5 | v50.5,30.5 55.5,30.5 IC3.13
N$44  (via drill 0.35)
  Top 0.2: v26.5,67.5 26.5,57.75 25.75,57 25.5,57 25.25,57.25 23.5,57.25 23.25,57 23,57 22.25,56.25 v22.25,49.5 22.25,42.5 20.5,40.75 20.5,34.25 18,31.75 17.75,31.75 17.25,31.25 17.25,31 16.75,30.5 V2.12 | v51.75,33.25 51.5,33.5 51.5,50.5 51,51 46.31,51 v45.56,50.25
  Bottom 0.2: v26.5,67.5 27.25,68.25 46,68.25 J3.1 | v51.75,33.25 55.5,33.25 IC3.14 | v22.25,49.5 36,49.5 36.75,50.25 v45.56,50.25
N$48  (via drill 0.35)
  Top 0.2: v42.25,10.5 42,10.75 42,14.5 45,17.5 45,37 44.5,37.5 44.5,38 44,38.5 44,38.75 43.25,38.75 B1.RESET@2
  Bottom 0.2: 29,6.25 29.5,6.25 31.25,4.5 31.75,4.5 J2.7 | 29,6.25 13.75,6.25 7.5,12.5 U$1.P$2 | v42.25,10.5 42,10.75 32.75,10.75 29.75,7.75 29.5,7.75 29,7.25 29,6.25
N$50  (via drill 0.35)
  Top 0.2: v30.5,6.25 30.5,25.75 28.5,27.75 V3.9
  Bottom 0.2: v30.5,6.25 42.5,6.25 44.25,4.5 J2.12
N$51  (via drill 0.35)
  Top 0.2: v33,5.5 31,7.5 31,30.5 29.25,32.25 29.25,32.75 28.5,32.75 V3.7
  Bottom 0.2: v33,5.5 33.25,5.75 40.5,5.75 41.75,4.5 J2.11
N$52
  Top 0.2: V3.5 28.5,37.75 29,37.75 29,37.5 31.5,35 31.5,10.5 35.75,6.25 38,6.25 39.25,5 39.25,4.5 J2.10
N$53
  Top 0.2: IC6.15 101,48.25 100,49.25 99.75,49.25 96,53 96,67.25 95,68.25 94.5,68.25 J3.20
  Bottom 0.2: IC4.11 86,42.25 87.75,44 97,44 101,48 IC6.15 | U$1.P$30 7.25,48.5 5.25,50.5 5.25,65 10,65 15.75,70.75 92,70.75 94.25,68.5 J3.20
N$54  (via drill 0.35)
  Top 0.2: v82,43.25 83.75,43.25 85,44.5 85.75,44.5 IC4.12 | J3.19 91.75,68.25 91.5,68 91.5,67.75 91.25,67.5 91.25,67.25 89.75,65.75 89.75,56.75 93.25,53.25 93.25,51 93.5,50.75 IC6.1
  Bottom 0.2: IC4.12 86,44.5 94.75,44.5 95.25,45 95.25,50.5 93.75,50.5 IC6.1 | v82,43.25 77.5,43.25 76.25,44.5 71,44.5 67.5,41 40.25,41 38.75,39.5 13.75,39.5 13.5,39.25 8.5,39.25 7.5,38.25 U$1.P$22
N$55
  Top 0.2: J3.18 89.25,68.25 89.25,56.5 90.5,55.25 90.55,55.25 92.84,52.96 92.84,51.87 91.91,50.95 91.91,49.63 IC6.2
  Bottom 0.2: IC4.13 86,47.25 86.75,48 93.5,48 IC6.2 | U$1.P$32 7.25,51 5.75,52.5 5.75,64.5 10.25,64.5 16,70.25 87.5,70.25 89.25,68.5 J3.18
N$56  (via drill 0.35)
  Top 0.2: v80.25,45.75 81,45.75 83.75,48.5 | 83.75,48.5 84.75,49.5 85.75,49.5 IC4.14 | 83.75,48.5 83.75,65 86.5,67.75 86.5,68 86.75,68.25 J3.17
  Bottom 0.2: IC4.14 85.75,49.5 84,47.75 84,45.75 93.25,45.75 93.5,45.5 IC6.3 | v80.25,45.75 77.25,45.75 76.75,45.25 71,45.25 67.25,41.5 27,41.5 26.75,41.25 16.75,41.25 16,42 8.5,42 7.5,43 U$1.P$26
N$57  (via drill 0.35)
  Top 0.2: v91.5,33.25 91.5,41.5 92.75,42.75 93.5,42.75 IC6.4 | J3.16 84.25,68.25 84,68 84,67.75 81.5,65.25 81.5,60.18 78.29,56.97 78.29,56.7 79.86,55.14 79.86,51.28 IC4.3 78.25,49.5
  Bottom 0.2: IC4.3 78.25,49.5 84,43.75 84,41 91.75,41 93.5,42.75 IC6.4 | v91.5,33.25 91.25,33 77.25,33 76.25,32 47.25,32 46.75,31.5 15.25,31.5 15,31.75 8.75,31.75 7.5,33 U$1.P$18
N$58  (via drill 0.35)
  Top 0.2: v9,65.75 9,47.25 7.5,45.75 U$1.P$28 | v83.5,71.5 82.25,70.25 82.25,70 82,69.75 82,68.5 J3.15 81.75,68.25 81.75,68 81,67.25 81,60.25 76,55.25 75.95,55.25 75.06,54.36 75.06,49.4 v75.18,49.28 | IC4.4 76.2,47.12 v76.07,47.24
  Bottom 0.2: IC4.4 78.25,47 78.75,46.5 80.5,46.5 83.5,43.5 83.5,40.5 93.5,40.5 IC6.5 | v9,65.75 10,66.75 11,66.75 15.75,71.5 v83.5,71.5 | v75.18,49.28 75.18,48.13 v76.07,47.24
N$59  (via drill 0.35)
  Top 0.2: v75.75,38.75 76,39 76,43.5 | 76,43.5 77,44.5 78,44.5 IC4.5 | 76,43.5 75.5,44 75.5,44.77 v74.3,45.97 | J3.14 79.25,68.25 79.5,68 79.5,67.75 80.5,66.75 80.5,60.5 75.5,55.5 75.44,55.5 74.3,54.36 v74.3,47.62
  Bottom 0.2: IC4.5 78.25,44.5 78.75,44 82.25,44 83,43.25 83,38 93.5,38 IC6.6 | v75.75,38.75 74.25,37.25 54.5,37.25 51.5,40.25 40.25,40.25 39,39 14,39 11.75,36.75 6.25,36.75 6.25,39.5 7.25,40.5 U$1.P$24 | v74.3,47.62 v74.3,45.97
N$60  (via drill 0.35)
  Top 0.2: 80.25,40.25 80.5,40 v80.5,33.75 | 80.25,40.25 79.75,40.75 79.5,40.75 78.25,42 IC4.6 | v12.5,36.5 12.25,36.75 10.25,36.75 10,36.5 8.75,36.5 8,35.75 7.5,35.75 U$1.P$20 | 80.25,40.25 80.25,44.75 79.5,45.5 79.5,46 79.86,46.36 79.86,50.06 79.68,50.23 79.68,50.54 80.26,51.11 80.26,55.3 78.73,56.84 81.9,60.01 81.9,60.06 81.92,60.07 81.92,64.62 81.9,64.63 82.25,64.98 v82.25,65
  Bottom 0.2: v80.5,33.75 80.75,34 92.25,34 93.5,35.25 IC6.7 | v12.5,36.5 12.75,36.25 27,36.25 27.25,36.5 37,36.5 39.25,34.25 39.25,32.5 44,32.5 46.25,34.75 46.25,36.75 74.75,36.75 76.5,38.5 76.5,42 78,42 IC4.6 | v82.25,65 80,65 76.75,68.25 J3.13
N$61  (via drill 0.35)
  Top 0.2: v49.75,44.25 50,44 50,31 49.75,30.75 49.75,30.25 50,30 50,27.5 v49.75,27.25 | v29,20 29,6.75 30,5.75 30,5.5 30.5,5 30.5,3.75 30.75,3.5 30.75,3.25 31.25,2.75 35.5,2.75 36.75,4 36.75,4.25 J2.9
  Bottom 0.2: v49.75,44.25 29.5,44.25 28.5,43.25 V3.3 | v49.75,27.25 49.5,27 44.75,27 37.75,20 v29,20
OUT_N_NET
  Bottom 0.2: V3.8 28.25,30.25 27.75,29.75 25.5,29.75 25.25,29.5 12.25,29.5 12,29.25 11,29.25 7.25,25.5 U$1.P$12
RD_N_NET  (via drill 0.35)
  Top 0.2: v14,44.5 13.75,44.25 13.75,37.75 13.25,37.25 13.25,32 11.5,30.25 U$1.P$15
  Bottom 0.2: v14,44.5 27.25,44.5 28.25,45.5 V3.2
RDH_N
  Bottom 0.2: IC2.18 73.25,28.25 76.75,31.75 96.25,31.75 98.75,34.25 102.25,34.25 103,35 103,42.75 101.25,42.75 IC6.13
VCC
  Top 0.2: V2.20 16.5,10 C6.2 16.5,7.5 16.5,6 16.25,5.75 16.25,5.5 16.5,5.25 16.5,4.5 J2.1 | IC2.1 68.25,20.5 68.25,28 IC2.20 68.25,28.25 68.25,29.25 70,31 70,42 71.25,43.25 C7.2 71.5,43.5 71.5,47 IC5.16 | C4.2 16.75,42.75 16.75,45.5 V1.20 | C2.2 36,53.25 37.25,52 37.25,50.25 36.25,49.25 36.25,48.5 36,48.25 V3.20 | 102.78,36.28 103.25,36.75 103.25,48.75 101.25,50.75 | 102.78,36.28 102.75,36.25 | 101.25,50.75 101.25,53.25 C3.2 | 101.25,50.75 IC6.16 | 102.78,36.28 102.13,36.28 IC6.10 101.16,34.79 99.53,33.16 99.53,32.37 101.16,30.74 101.16,12 IC1.3
  Bottom 0.2: C9.2 65.25,28.25 68,28.25 IC2.20 | V2.20 16.75,10.25 20.75,14.25 42.25,14.25 47.25,19.25 67,19.25 68,20.25 IC2.1 | V1.20 17,45.75 17.5,46.25 23,46.25 23.75,47 34.5,47 35.5,48 35.75,48 V3.20 36,48.25 36.5,48.75 69.75,48.75 70,49 73.5,49 | IC3.16 55.75,38.25 58.25,38.25 C1.2 58.5,38.25 60.75,40.5 68.5,40.5 71.25,43.25 C7.2 | C3.2 101,53.5 90.25,53.5 89.25,54.5 C8.2 89,54.75 86,54.75 IC4.16 85.75,54.5 82.25,51 77.5,51 76.5,50 74.5,50 73.5,49 | 73.5,49 71.75,47.25 IC5.16 | IC1.3 C5.1
WAIT/  (via drill 0.35)
  Top 0.2: B1.D2 48.5,13.25 50,14.75 v50,22.75 51.25,24 51.25,30.75 50.5,31.5 50.5,46.5 v50.25,46.75 | v33.75,46.25 v33.75,52.75
  Bottom 0.2: v50,22.75 53.75,26.5 65.5,26.5 65.75,26.25 68.75,26.25 70.5,28 IC2.19 | v33.75,52.75 32.25,54.25 12.25,54.25 11.5,53.5 U$1.P$33 | v33.75,46.25 34,46.5 34.75,46.5 35,46.75 v50.25,46.75
WR_N_NET  (via drill 0.35)
  Top 0.2: v26.25,29 26.25,38.5 V3.4
  Bottom 0.2: v26.25,29 12.5,29 11.5,28 U$1.P$13

### Text on the board
tNames: TRS-80 Model 1 Arduino Interface